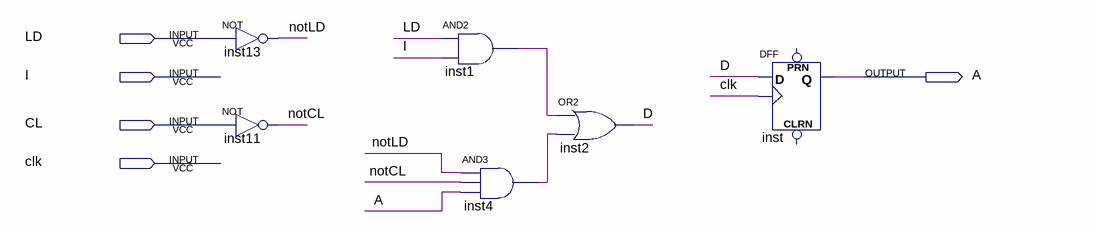
[diagram p0: schematic sheet]
// Quartus schematic REG1_LD_CL.bdf as structural Verilog: 6 symbols, 5 pins
module REG1_LD_CL (
  input  LD,
  input  I,
  input  CL,
  input  clk,
  output A
);

  wire D, inst1_out, inst4_out, notCL, notLD;

  not inst13 (notLD, LD);
  not inst11 (notCL, CL);
  and inst1 (inst1_out, LD, I);
  and inst4 (inst4_out, notLD, notCL, A);
  or inst2 (D, inst1_out, inst4_out);
  DFF inst (.CLK(clk), .D(D), .Q(A));  // open: CLRN, PRN
endmodule
